# Altium schematic sheet 输出.SchDoc
size A4
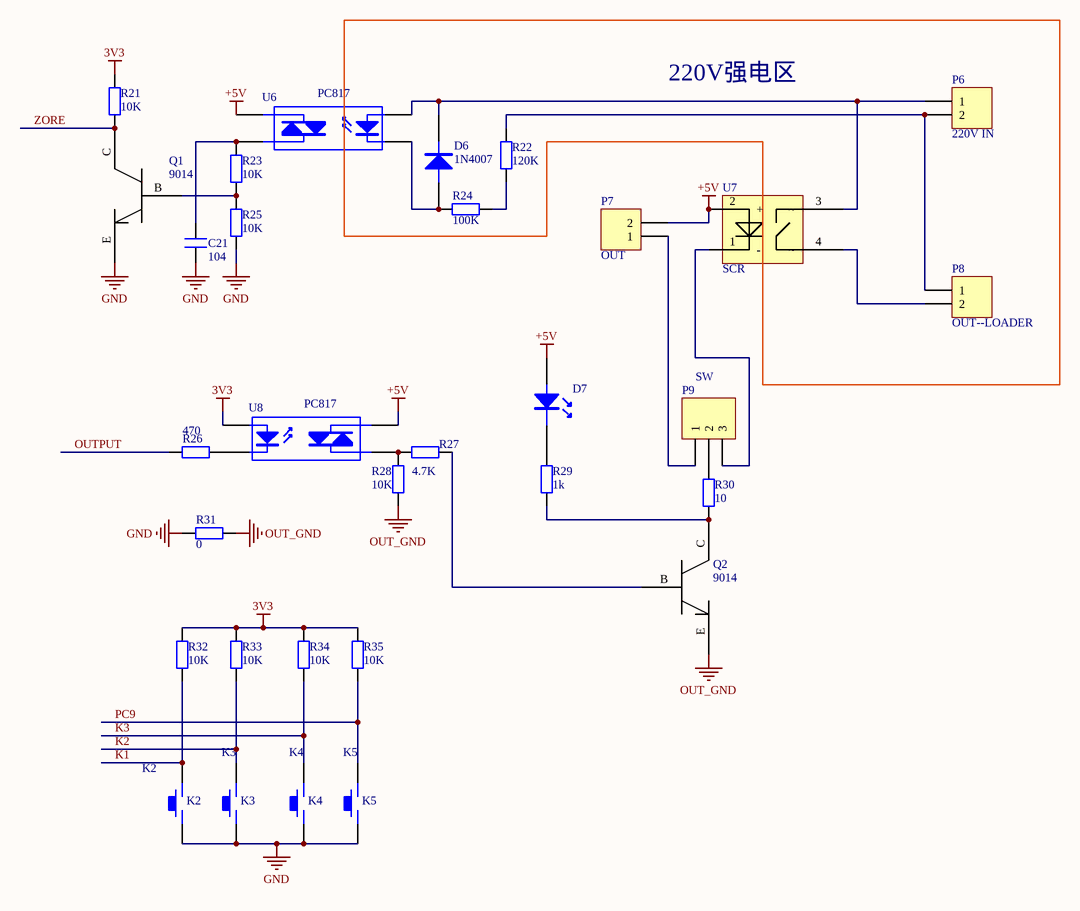
[diagram p0: 输出.SchDoc]

## Parts
C21  104  [1206]
D6  1N4007
D7  (no value)  [LED]
K2  K2  [KEY_M]
K3  K3  [KEY_M]
K4  K4  [KEY_M]
K5  K5  [KEY_M]
P6  220V IN  [OUT_CJ]
P7  OUT  [HDR1X2]
P8  OUT--LOADER  [OUT_CJ]
P9  SW  [HDR1X3]
Q1  9014  [9014]
Q2  9014  [9014]
R21  10K  [1206]
R22  120K  [1206]
R23  10K  [1206]
R24  100K  [1206]
R25  10K  [1206]
R26  470  [1206]
R27  4.7K  [1206]
R28  10K  [1206]
R29  1k  [1206]
R30  10  [1206]
R31  0  [1206]
R32  10K  [1206]
R33  10K  [1206]
R34  10K  [1206]
R35  10K  [1206]
U6  PC817  [pc817]
U7  SCR  [SCR]
U8  PC817  [pc817]

## Blocks framed on the sheet
220V强电区: D6 P6 P8 R22 R24 U7

## Nets
3V3: R21.2 R32.2 R33.2 R34.2 R35.2 U8.1(A)
+5V: D7.A P7.2 U6.3(A/K) U7.2(+) U8.3(A/K)
GND: C21.2 K2.1 K3.1 K4.1 K5.1 Q1.E R25.1 R31.2
OUT_GND: Q2.E R28.1 R31.1
K1: K2.2 R32.1
K2: K3.2 R33.1
K3: K4.2 R34.1
OUTPUT: R26.2
PC9: K5.2 R35.1
ZORE: Q1.C R21.1
NetC21_1: C21.1 R23.2 U6.4(A/K)
NetD6_1: D6.1(A) R24.1 U6.2(K)
NetD6_2: D6.2(K) P6.1 U6.1(A) U7.3
NetD7_K: D7.K R29.2
NetP6_2: P6.2 P8.1 R22.1
NetP7_1: P7.1 P9.1
NetP8_2: P8.2 U7.4
NetP9_2: P9.2 R30.2
NetP9_3: P9.3 U7.1(-)
NetQ1_B: Q1.B R23.1 R25.2
NetQ2_B: Q2.B R27.1
NetQ2_C: Q2.C R29.1 R30.1
NetR22_2: R22.2 R24.2
NetR26_1: R26.1 U8.2(K)
NetR27_2: R27.2 R28.2 U8.4(A/K)

## Library data of the parts
C21 = C
D6 = DIODE
D7 = 发光二极管
K2-K5 = KEY_M
P6-P8 = Header 2: Header, 2-Pin; LatestRevisionDate: 17-Jul-2002; LatestRevisionNote: Re-released for DXP Platform.; Publisher: Altium Limited
P9 = Header 3: Header, 3-Pin; LatestRevisionDate: 17-Jul-2002; LatestRevisionNote: Re-released for DXP Platform.; Publisher: Altium Limited
R21 R23 R25 R28 R32-R35 = Res2: Resistor; Published: 8-Jun-2000; LatestRevisionDate: 17-Jul-2002; LatestRevisionNote: Re-released for DXP Platform.; PackageReference: AXIAL-0.4; Publisher: Altium Limited; PackageDescription: Axial Device, Thru-Hole; 2 Leads; 0.4 in Pin Spacing; Value: 10K
R22 R24 R26 R27 R29-R31 = Res2: Resistor; Value: 10K; Published: 8-Jun-2000; LatestRevisionDate: 17-Jul-2002; LatestRevisionNote: Re-released for DXP Platform.; PackageReference: AXIAL-0.4; Publisher: Altium Limited; PackageDescription: Axial Device, Thru-Hole; 2 Leads; 0.4 in Pin Spacing
U6 U8 = OPTOTRIAC